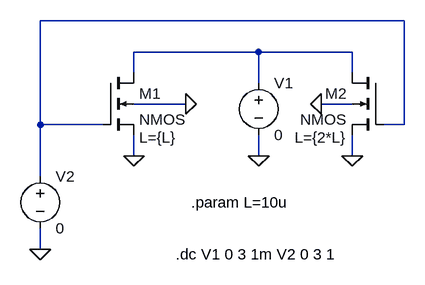
[diagram p0: schematic L_Mos.asc]
L_Mos.asc, the LTspice schematic file:
Version 4
SHEET 1 880 680
WIRE 32 240 112 240
WIRE 320 240 368 240
WIRE 224 320 224 288
WIRE 224 208 224 160
WIRE 224 160 368 160
WIRE 368 160 368 192
WIRE 368 288 368 320
WIRE 32 320 32 288
WIRE 32 192 32 160
WIRE 32 160 224 160
WIRE -112 464 -112 432
WIRE -112 352 -112 272
WIRE -16 272 -112 272
WIRE -112 272 -112 112
WIRE -112 112 448 112
WIRE 448 112 448 272
WIRE 448 272 416 272
FLAG 112 240 0
FLAG 320 240 0
FLAG 368 320 0
FLAG 32 320 0
FLAG 224 320 0
FLAG -112 464 0
SYMBOL nmos4 -16 192 R0
WINDOW 123 56 100 Left 0
SYMATTR InstName M1
SYMATTR Value2 L={L}
SYMBOL nmos4 416 192 M0
WINDOW 123 56 100 Left 0
SYMATTR InstName M2
SYMATTR Value2 L={2*L}
SYMBOL voltage 224 192 R0
SYMATTR InstName V1
SYMATTR Value 0
SYMBOL voltage -112 336 R0
SYMATTR InstName V2
SYMATTR Value 0
TEXT 120 392 Left 0 !.param L=10u
TEXT 96 472 Left 0 !.dc V1 0 3 1m V2 0 3 1

The netlist it stands for:
* L_Mos.asc
M1 N001 N002 0 0 NMOS L={L}
M2 N001 N002 0 0 NMOS L={2*L}
V1 N001 0 0
V2 N002 0 0
.model NMOS NMOS
.model PMOS PMOS
.lib standard.mos
.param L=10u
.dc V1 0 3 1m V2 0 3 1
.backanno
.end